# EAGLE design m101-psu-dcdc (EAGLE 7.6.0)
Assembly variants: 9V-36V Input (Pos ON), 9V-36V Input (Neg ON), +15V/0/-15V Input
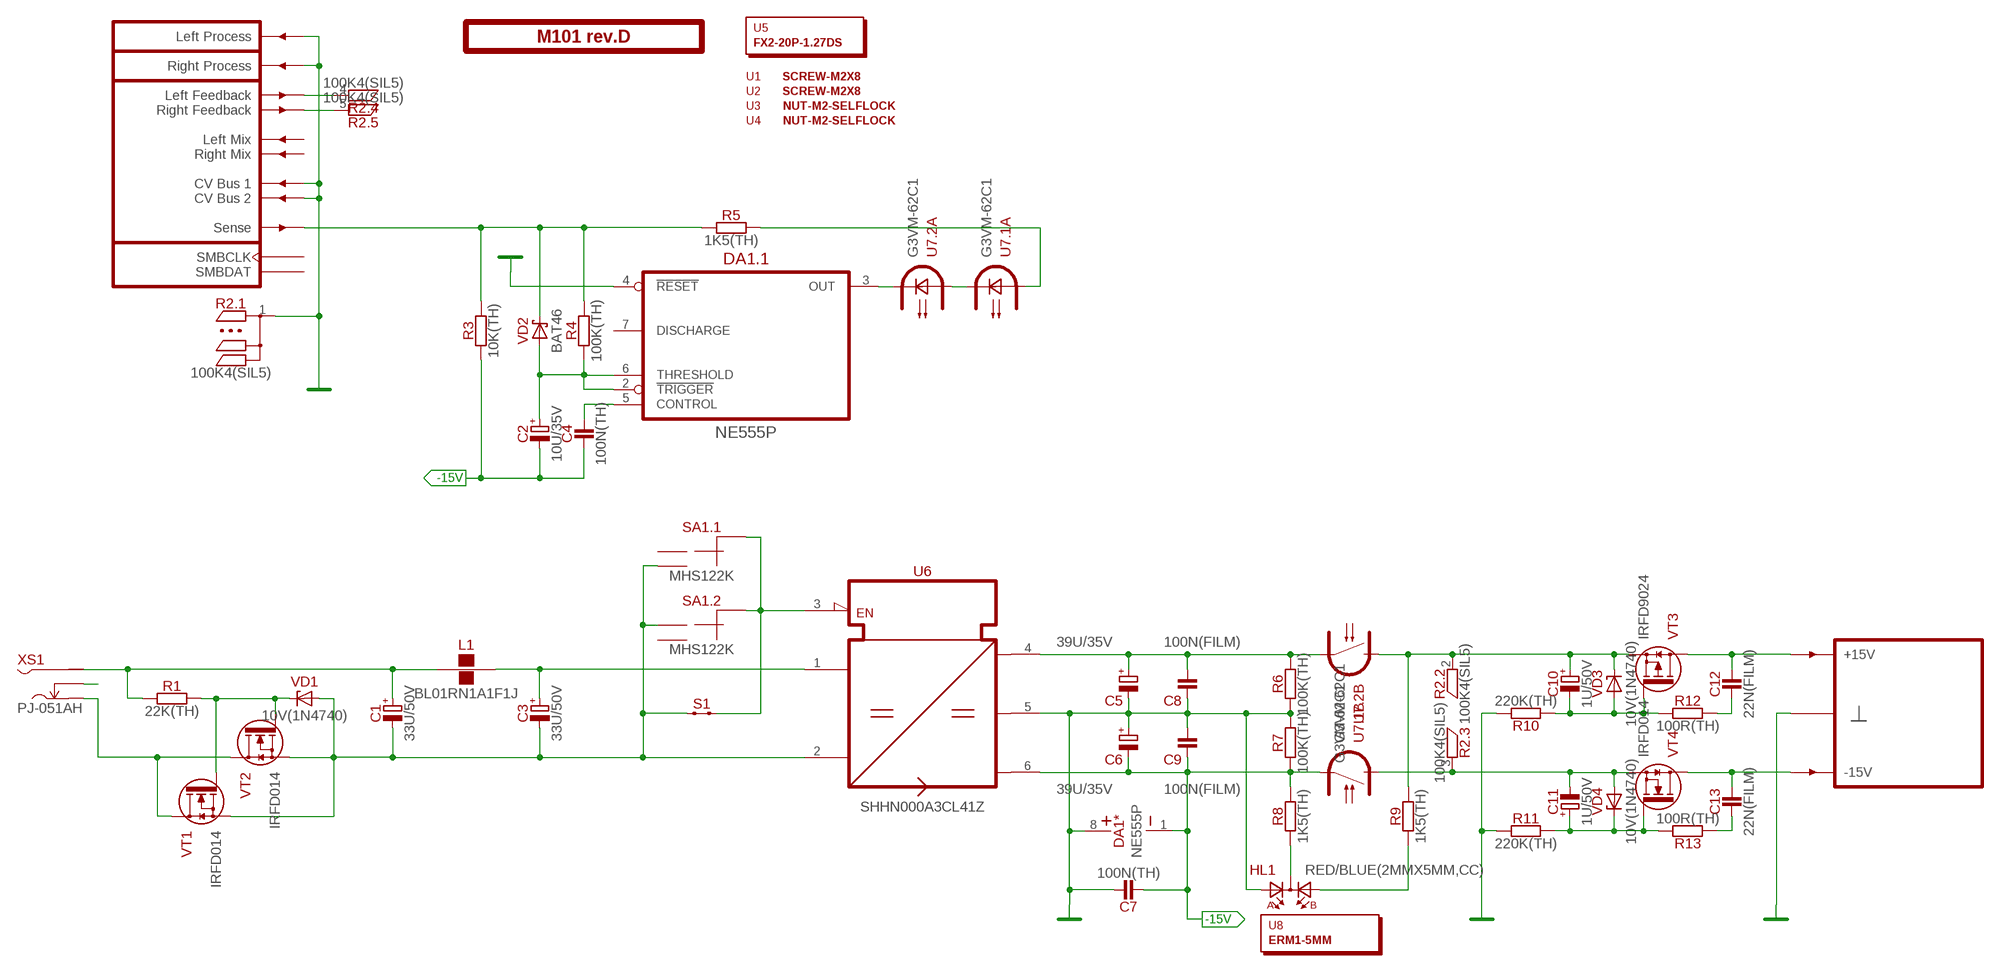
[diagram p0: schematic, sheet 1]

## Parts
C1  33U/50V  [E3,5-8]
C2  10U/35V  [E2-5]
C3  33U/50V  [E3,5-8]
C4  100N(TH)  [C050-024X044]
C5  39U/35V  [E3,5-8]
C6  39U/35V  [E3,5-8]
C7  100N(TH)  [C050-024X044]
C8  100N(FILM)  [C050-025X075]
C9  100N(FILM)  [C050-025X075]
C10  1U/50V  [E1,5-4]
C11  1U/50V  [E1,5-4]
C12  22N(FILM)  [C050-025X075]
C13  22N(FILM)  [C050-025X075]
DA1  NE555P  [DIP-8]
HL1  RED/BLUE(2MMX5MM,CC)  [LED2X5-3PIN]
L1  BL01RN1A1F1J  [BL01RN1A]  (not fitted in variant +15V/0/-15V Input)
PCB1  M101 rev.D  ST2-BOARD-50-PSU  [ST2-BOARD-50-PSU]
R1  22K(TH)  [R-0207/10]
R2  100K4(SIL5)  [R-SIL5]
R3  10K(TH)  [R-0207/10]
R4  100K(TH)  [R-0207/10]
R5  1K5(TH)  [R-0207/10]
R6  100K(TH)  [R-0207/10]
R7  100K(TH)  [R-0207/10]
R8  1K5(TH)  [R-0207/10]
R9  1K5(TH)  [R-0207/10]
R10  220K(TH)  [R-0207/10]
R11  220K(TH)  [R-0207/10]
R12  100R(TH)  [R-0207/10]
R13  100R(TH)  [R-0207/10]
S1  JUMPER-1POS-SOLDER  [JP1-SOLDER]
SA1  MHS122K  [APEM-MHS122K]
U1  SCREW-M2X8  [EMPTY]
U2  SCREW-M2X8  [EMPTY]
U3  NUT-M2-SELFLOCK  [EMPTY]
U4  NUT-M2-SELFLOCK  [EMPTY]
U5  FX2-20P-1.27DS  [EMPTY]
U6  SHHN000A3CL41Z  [DC/DC-C1]  (not fitted in variant +15V/0/-15V Input)
U7  G3VM-62C1  [DIL08]
U8  ERM1-5MM  [EMPTY]
VD1  10V(1N4740)  [DO41-10]
VD2  BAT46  [DO35-7]
VD3  10V(1N4740)  [DO41-10]
VD4  10V(1N4740)  [DO41-10]
VT1  IRFD014  [HVMDIP-4]
VT2  IRFD014  [HVMDIP-4]
VT3  IRFD9024  [HVMDIP-4]
VT4  IRFD014  [HVMDIP-4]
XS1  PJ-051AH  [PJ-051AH]

## Nets
-15V: C2.- C4.1 C6.- C7.1 C9.1 DA1.1(*:V-) R3.1 R7.1 R8.2 U6.6(V-) U7.7(.1B:S2)
GND: C5.- C6.+ C7.2 C8.1 C9.2 DA1.4(.1:!RESET) DA1.8(*:V+) HL1.A1 PCB1.ACV1'(CV1') PCB1.ACV2'(CV2') PCB1.B4'(GND) PCB1.B5'(GND) PCB1.B6'(GND) PCB1.B7'(GND) PCB1.B8'(GND) PCB1.BOUTL'(OUTL) PCB1.BOUTR'(OUTR) R2.1 R6.1 R7.2 R10.2 R11.2 U6.5(GND)
N$1: R5.2 U7.1(.1A:A)
N$2 [power]: XS1.2(SS)
N$3 [power]: C1.- C3.- S1.1 SA1.1' SA1.2 U6.2(IN-) VD1.A VT1.4(S) VT2.4(S)
N$4: PCB1.ALFBK'(LFBK') R2.4
N$5: PCB1.ARFBK'(RFBK') R2.5
N$6: C4.2 DA1.5(.1:CONTROL)
N$7: DA1.3(.1:OUT) U7.4(.2A:C)
N$8 [power]: VT1.1(D) VT1.2(D) VT2.1(D) VT2.2(D) XS1.3(S)
N$9: U7.2(.1A:C) U7.3(.2A:A)
N$10: C2.+ DA1.2(.1:!TRIGGER) DA1.6(.1:THRESHOLD) R4.1 VD2.A
N$11: C10.+ R2.2 R9.2 U7.6(.2B:S1) VD3.C VT3.4(S)
N$12 [power]: R1.2 VD1.C VT1.3(G) VT2.3(G)
N$13: HL1.K R8.1
N$14: HL1.A2 R9.1
N$15: C5.+ C8.2 R6.2 U6.4(V+) U7.5(.2B:S2)
N$16 [power]: S1.2 SA1.CMN'(.2:CM) SA1.CMN(.1:CM) U6.3(EN)
N$17: C10.- R10.1 R12.1 VD3.A VT3.3(G)
N$18: C12.2 PCB1.A+15'(P+15V) PCB1.B+15'(P+15V) VT3.1(D) VT3.2(D)
N$19: C12.1 R12.2
N$20 [power]: C1.+ L1.1 R1.1 XS1.1(P)
N$21: C13.1 PCB1.A-15'(P-15V) PCB1.B-15'(P-15V) VT4.1(D) VT4.2(D)
N$22 [power]: C3.+ L1.2 U6.1(IN+)
N$23: C13.2 R13.2
N$24: C11.+ R11.1 R13.1 VD4.C VT4.3(G)
N$25: C11.- R2.3 U7.8(.1B:S1) VD4.A VT4.4(S)
SENSE: PCB1.BSENSE'(SENSE') R3.2 R4.2 R5.1 VD2.C
Unconnected: DA1.7(.1:DISCHARGE) PCB1.ALMIX'(LMIX') PCB1.ARMIX'(RMIX') PCB1.ASMBCLK'(SMBCLK) PCB1.ASMBDAT'(SMBDAT) SA1.1 SA1.2'

## Library data of the parts
C1 C3 = capacitors-electrolytic:?; MOUSER: 661-EKZE500ELL330MH0
C2 = capacitors-electrolytic:?; MOUSER: 647-USW1V100MDD
C4 C7 = capacitors:?; MOUSER: 81-RCER71H104K0A2H3B
C5 C6 = capacitors-electrolytic:?; MOUSER: 667-35SEPF39M
C8 C9 = capacitors:?; MOUSER: 505-MKS2.1/63/5
C10 C11 = capacitors-electrolytic:?; MOUSER: 647-USW1H010MDD
C12 C13 = capacitors:?; MOUSER: 80-R82EC2220DQ50J
DA1 = ic-logic:NE555?; MOUSER: 595-NE555P
HL1 = optoelectronics:?(2MMX5MM,CC)
L1 = inductors:BL01RN1A?; MOUSER: 81-BL01RN1A1F1J
PCB1 = module-footprints:ST2-BOARD-50-PSU
R1 = resistors:?; MOUSER: 71-CCF0722K0GKE36
R2 = resistors:?**4(SIL5); MOUSER: 652-4605X-1LF-100K
R3 = resistors:?; MOUSER: 71-RN55D-F-10K
R4 R6 R7 = resistors:?; MOUSER: 71-RN55D-F-100K
R5 R8 R9 = resistors:?; MOUSER: 71-CCF071K50GKE36
R10 R11 = resistors:?
R12 R13 = resistors:?; MOUSER: 71-RN55D-F-100/R
S1 = switches:JUMPER-1POS-SOLDER
SA1 = switches:MHS122K; MOUSER: 642-MHS122K
U1-U4 = hardware:*?
U5 = hardware:?; MOUSER: 798-FX2-20P-1.27DS71
U6 = regulators-switch-mode:SHHN000A3CL41Z; MOUSER: 894-SHHN000A3CL41Z
U7 = optoelectronics:G3VM-?2C; MOUSER: 653-G3VM-62C1
U8 = hardware:?
VD1 VD3 VD4 = diodes-zener:?
VD2 = diodes-schottky:?; MOUSER: 511-BAT46
VT1 VT2 VT4 = transistors-fet:IRFD014
VT3 = transistors-fet:IRFD9024
XS1 = connectors:PJ-051?; MOUSER: 490-PJ-051AH

## Net classes
1 power: clearance 0.508 mm

## Board
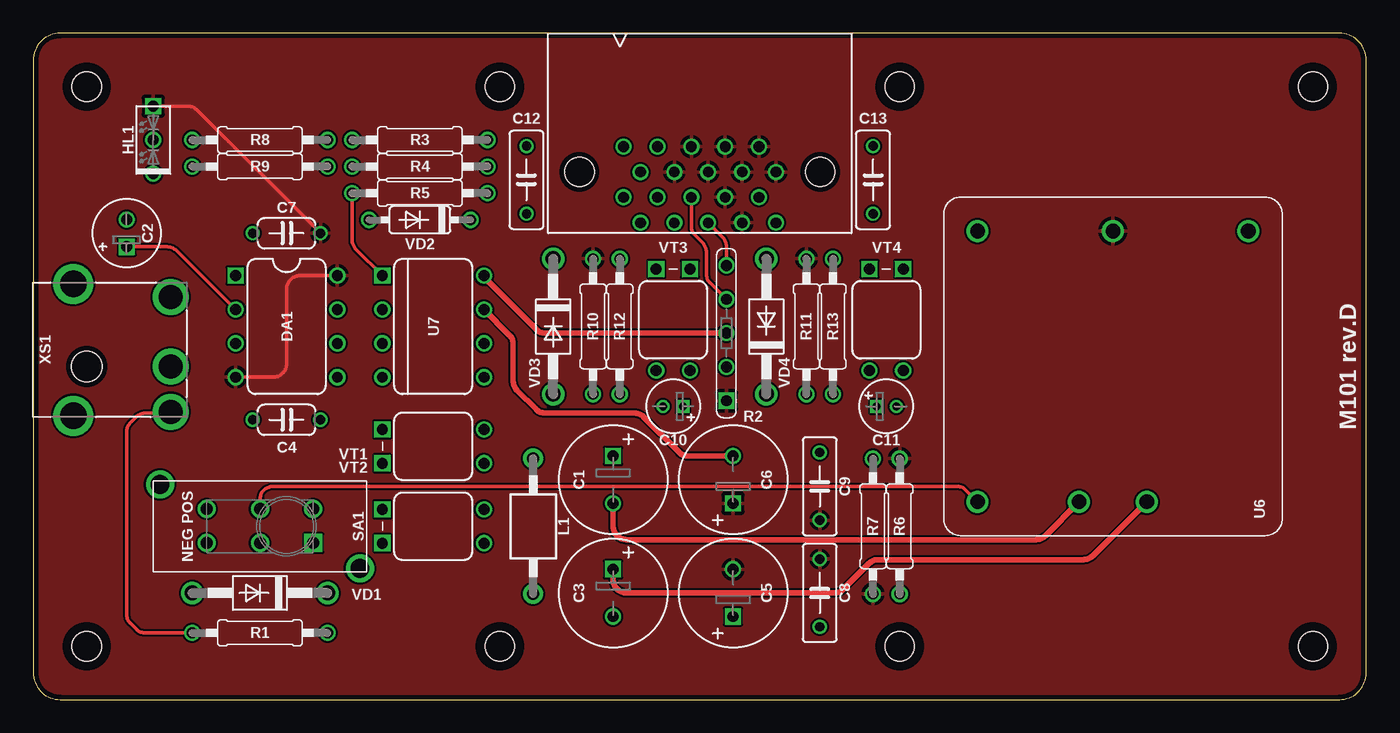
[diagram p1: board, top side]
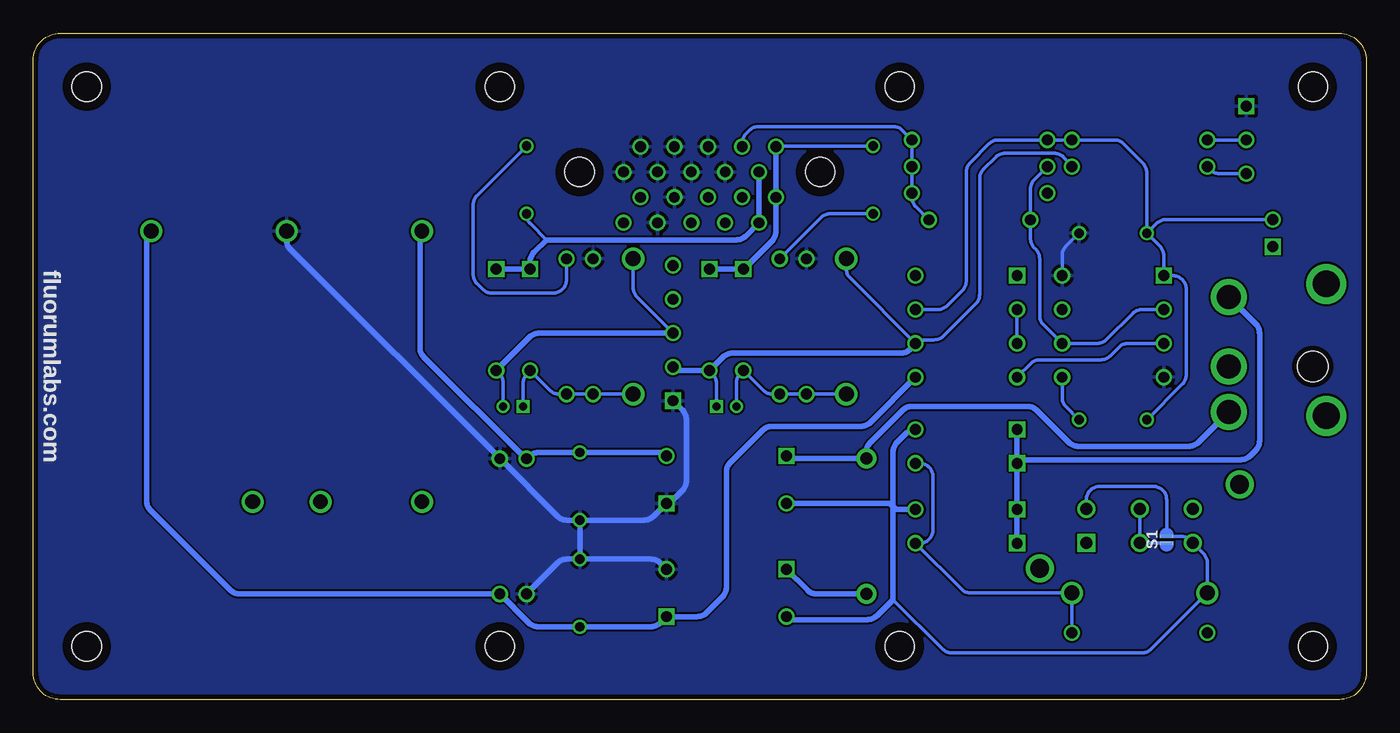
[diagram p2: board, bottom side, seen from below]

Size 100 x 50 mm. Coordinates in mm from the lower left corner, seen from the top.
Outline: 0,48 0,2 arc90 2,0 98,0 arc90 100,2 100,48 arc90 98,50 2,50 arc90 0,48
Copper layers (1*16): Top 0.0356mm / dielectric 1.5011mm / Bottom 0.0356mm
Design rules "LaenPCBOrder": minimum track width 6mil, minimum drill 13mil, track to track 6mil, track to pad 6mil, pad to pad 6mil, via to via 6mil, smd to smd 6mil, copper to edge 15mil, drill to drill 6mil, minimum pad ring 7mil, minimum via ring 7mil, stop-mask expansion 3mil, vias tented up to drill 0mil, thermal gap 10mil

### Footprints (pad centres in the part's own frame; a part is rotated, then mirrored left to right if it is on the bottom)
E3,5-8 = drill 0.813 square: + -1.778,0 | drill 0.813: - 1.778,0
E2-5 = drill 0.813 square: + -1.016,0 | drill 0.813: - 1.016,0
C050-024X044 = drill 0.7: 1 -2.54,0; 2 2.54,0
C050-025X075 = drill 0.7: 1 -2.54,0; 2 2.54,0
E1,5-4 = drill 0.6 square: + -0.75,0 | drill 0.6: - 0.75,0
DIP-8 = drill 0.813 square: 1 -3.81,-3.81 | drill 0.813: 2 -1.27,-3.81; 3 1.27,-3.81; 4 3.81,-3.81; 5 3.81,3.81; 6 1.27,3.81; 7 -1.27,3.81; 8 -3.81,3.81
LED2X5-3PIN = drill 0.813 square: A1 -2.54,0 | drill 0.813: A2 2.54,0; K 0,0
BL01RN1A = drill 0.9 pad 1.5: 1 -5.08,0; 2 5.08,0
ST2-BOARD-50-PSU = drill 0.8: A+15' 44.285,37.69; A-15' 45.555,35.785; ACV1' 51.905,37.69; ACV2' 53.175,35.785; ALFBK' 49.365,37.69; ALMIX' 46.825,37.69; ARFBK' 50.635,35.785; ARMIX' 48.095,35.785; ASMBCLK' 55.715,35.785; ASMBDAT' 54.445,37.69; B4' 48.095,39.595; B5' 49.365,41.5; B6' 50.635,39.595; B7' 51.905,41.5; B8' 53.175,39.595; B+15' 44.285,41.5; B-15' 45.555,39.595; BOUTL' 54.445,41.5; BOUTR' 55.715,39.595; BSENSE' 46.825,41.5 | hole 2.2: 4,4; 4,46; 96,4; 96,46; 35,46; 65,46; 65,4; 35,4; 40.975,39.595; 59.025,39.595
R-0207/10 = drill 0.813: 1 -5.08,0; 2 5.08,0
R-SIL5 = drill 0.813 square: 1 -5.08,0 | drill 0.813: 2 -2.54,0; 3 0,0; 4 2.54,0; 5 5.08,0
JP1-SOLDER = smd 0.254 x 1.016: 1 -0.254,0.026; 2 0.254,0.026
APEM-MHS122K = drill 0.9 square: 1 -4,1.25 | drill 0.9: 1' -4,-1.29; 2 4,1.25; 2' 4,-1.29; CMN 0,1.25; CMN' 0,-1.29 | drill 1.4: S1 -7.5,3.15; S2 7.5,-3.15
DC/DC-C1 = drill 1.1: 1 -10.16,-2.54; 2 -10.16,2.54; 3 -10.16,10.16; 4 10.16,-10.16; 5 10.16,0; 6 10.16,10.16
DIL08 = drill 0.813 square: 1 -3.81,-3.81 | drill 0.813: 2 -1.27,-3.81; 3 1.27,-3.81; 4 3.81,-3.81; 5 3.81,3.81; 6 1.27,3.81; 7 -1.27,3.81; 8 -3.81,3.81
DO41-10 = drill 1.118: A 5.08,0; C -5.08,0
DO35-7 = drill 0.813: A 3.81,0; C -3.81,0
HVMDIP-4 = drill 0.813 square: 1 -1.27,-3.81; 2 1.27,-3.81 | drill 0.813: 3 1.27,3.81; 4 -1.27,3.81
PJ-051AH = drill 1.8: 1 10.3,-3.4; 2 10.3,0; 3 10.3,5.2 | drill 2: S1 3,6.2; S2 3,-3.7 | hole 2.3: 4,0

### Placement (x,y rotation side)
C1  43.5,16.5 270 top
C2  7,35 90 top
C3  43.5,8 270 top
C4  19,21 0 top
C5  52.5,8 90 top
C6  52.5,16.5 90 top
C7  19,35 0 top
C8  59,8 270 top
C9  59,16 270 top
C10  48,22 180 top
C11  64,22 0 top
C12  37,39 90 top
C13  63,39 90 top
DA1  19,28 270 top
HL1  9,42 270 top
L1  37.5,13 270 top
PCB1  0,0 0 top
R1  17,5 0 top
R2  100K*4(SIL5)  [R-SIL5]  52,27.5 90 top
R3  29,42 0 top
R4  29,40 0 top
R5  29,38 180 top
R6  65,13 270 top
R7  63,13 270 top
R8  17,42 0 top
R9  17,40 0 top
R10  42,28 90 top
R11  58,28 90 top
R12  44,28 90 top
R13  60,28 90 top
S1  15,12 270 bottom
SA1  17,13 180 top
U1  -83,-103 0 top  (outside the outline)
U2  -84,-105 0 top  (outside the outline)
U3  -85,-107 0 top  (outside the outline)
U4  -86,-109 0 top  (outside the outline)
U5  -81,-99 0 top  (outside the outline)
U6  81,25 90 top
U7  30,28 270 top
U8  -82,-101 0 top  (outside the outline)
VD1  17,8 180 top
VD2  29,36 180 top
VD3  39,28 270 top
VD4  55,28 90 top
VT1  30,19 270 top
VT2  30,13 270 top
VT3  48,28.5 180 top
VT4  64,28.5 180 top
XS1  0,25 0 top

### Tracks (layer width: path | path; a pad name or v marks a point on that pad's centre or on a via)
-15V
  Top 0.406: C6.- 49.14,18.28 arc-45 48.43,18.57 45.79,21.21 arc45 45.09,21.5 38.41,21.5 arc-45 37.71,21.79 36.29,23.21 arc-45 36,23.91 36,26.67 arc45 35.71,27.37 U7.7
  Bottom 0.254: C7.1 15.48,34.02 arc45 15.19,33.32 DA1.1 14.5,31.81 arc90 13.5,30.81 13.5,24.37 arc45 13.79,23.67 C4.1 | C7.1 16.46,39.55 arc-45 16.75,40.25 18.21,41.71 arc-45 18.91,42 R8.2 R3.1 27.59,42 arc-45 28.29,41.71 29.71,40.29 arc-45 30,39.59 30,31.41 arc45 30.29,30.71 31.44,29.56 arc45 32.14,29.27 U7.7 | C2.- 15.03,36.02 arc-45 15.74,35.72 C7.1
  Bottom 0.406: C6.- arc-45 53.13,18.54 C9.1 62.13,18.54 arc-45 62.83,18.25 R7.1 63.08,18.08 70.71,25.71 arc45 71,26.41 71,35 U6.6
GND
  Top 0.254: DA1.4 18,24.19 arc90 19,25.19 19,30.81 arc-90 20,31.81 DA1.8 | HL1.A1 11.59,44.54 arc-45 12.29,44.25 C7.2
  Bottom 0.254: DA1.8 22.81,33.32 arc45 22.52,34.02 C7.2
  Bottom 0.406: C8.1 53.68,10.54 arc45 52.97,10.25 C5.- | C9.2 54.18,13.46 arc-45 53.47,13.75 C6.+ 52.28,14.72 51.29,15.71 arc-45 51,16.41 51,21.01 arc-45 51.29,21.71 R2.1 | C8.1 C9.2 | C8.1 59.97,10.54 arc-45 60.67,10.25 R7.2 | C9.2 59.97,13.46 arc45 60.67,13.75 R6.1 80.71,33.79 arc45 81,34.49 U6.5
  pour Bottom: 0,50 100,50 100,0 0,0
  pour Top: 0,50 100,50 100,0 0,0
N$1
  Top 0.254: R5.2 23.92,34.49 arc45 24.21,33.79 U7.1
N$3
  Top 0.406: C1.- 43.5,13 arc90 44.5,12 75.21,12 arc45 75.91,12.29 U6.2
  Bottom 0.254: SA1.1' 21,15 arc90 20,16 15.97,16 arc90 14.97,15 S1.1 13.92,12.25 arc45 13.21,11.96 SA1.2 12.21,10.96 arc45 11.92,10.26 VD1.A 16.13,3.79 arc45 16.83,3.5 31.09,3.5 arc45 31.79,3.79 35.5,7.5
  Bottom 0.406: VT1.4 VT1.4 arc-45 34.52,19.98 35.21,19.29 arc-45 35.5,18.59 35.5,14.5 | 35.5,14.5 35.5,7.5 36.71,6.29 arc45 37.41,6 43.28,6 C3.- | VT2.4 35.27,14.27 35.5,14.5 | C1.- 35.72,14.72 35.5,14.5
N$4
  Top 0.254: PCB1.ALFBK' 49.37,35.55 arc45 49.66,34.84 50.21,34.29 arc-45 50.5,33.59 50.5,31.95 arc45 50.79,31.25 R2.4
N$5
  Top 0.254: R2.5 52,34.01 arc45 51.71,34.71 PCB1.ARFBK'
N$6
  Bottom 0.254: DA1.5 22.81,22.68 arc-45 22.52,21.98 C4.2
N$7
  Bottom 0.254: DA1.3 17.86,26.73 arc-45 18.56,26.44 19.21,25.79 arc45 19.91,25.5 24.47,25.5 arc-45 25.17,25.21 U7.4
N$8
  Bottom 0.406: VT1.2 25.92,18 9.41,18 arc-45 8.71,18.29 8.29,18.71 arc-45 8,19.41 8,27.49 arc-45 8.29,28.19 XS1.3 | VT1.1 VT1.2 | VT1.2 VT2.1 VT2.2
N$9
  Bottom 0.254: U7.3 U7.2
N$10
  Top 0.254: C2.+ 9.95,33.98 arc-45 10.85,33.61 DA1.2
  Bottom 0.254: R4.1 24.9,39.02 arc-45 25.19,38.32 VD2.A 25.19,34.6 arc-45 24.9,33.9 24.79,33.79 arc45 24.5,33.09 24.5,28.83 arc-45 24.21,28.13 DA1.6 20.18,26.73 arc-45 19.48,27.02 17.52,28.98 arc45 16.82,29.27 DA1.2
N$11
  Bottom 0.254: C10.+ 48.75,23.76 arc-45 49.04,24.46 VT3.4 | R9.2 22.08,40.08 22.71,40.71 arc-45 23.41,41 27.09,41 arc-45 27.79,40.71 28.71,39.79 arc-45 29,39.09 29,30.41 arc45 29.29,29.71 31.71,27.29 arc45 32.41,27 33.54,27 U7.6 38.71,31.63 arc45 39,32.33 VD3.C
  Bottom 0.406: U7.6 33.81,26.69 34.21,26.29 arc45 34.91,26 47.55,26 arc-45 48.25,25.71 VT3.4 51.73,24.69 R2.2
N$12
  Bottom 0.254: R1.2 VD1.C 29.67,8 arc45 30.37,8.29 VT2.3 33.5,11.73 arc-90 32.5,12.73 32.5,16.73 arc-90 33.5,17.73 VT1.3
N$13
  Bottom 0.254: HL1.K R8.1
N$14
  Bottom 0.254: HL1.A2 10.97,39.46 arc45 11.67,39.75 R9.1
N$15
  Bottom 0.406: U6.4 91.5,34.82 91.5,14.91 arc-45 91.21,14.21 85.21,8.21 arc-45 84.51,7.92 R6.2 62.83,5.75 arc-45 62.13,5.46 C8.2 53.68,5.46 arc-45 52.97,5.75 C5.+ 50.19,6.22 arc-45 49.48,6.51 48.29,7.71 arc-45 48,8.41 48,17.09 arc45 47.71,17.79 45.29,20.21 arc45 44.59,20.5 37.91,20.5 arc-45 37.21,20.79 U7.5
N$16
  Top 0.254: SA1.CMN' 17,15 arc-90 18,16 69.27,16 arc-45 69.97,15.71 U6.3
  Bottom 0.254: SA1.CMN' SA1.CMN S1.2
N$17
  Bottom 0.254: VD3.A R10.1 R12.1 44.55,22.92 arc45 45.25,23.21 VT3.3 46.96,24.46 arc-45 47.25,23.76 C10.-
N$18
  Bottom 0.254: C12.2 44.24,41.54 PCB1.B+15'
  Bottom 0.406: VT3.1 VT3.2 46.69,32.31 44.58,34.42 arc-45 44.28,35.13 PCB1.A+15' PCB1.B+15'
N$19
  Bottom 0.254: C12.1 40.21,36.46 arc-45 40.91,36.17 R12.2
N$20
  Top 0.254: R1.1 8.41,5 arc-45 7.71,5.29 7.29,5.71 arc-45 7,6.41 7,20.09 arc-45 7.29,20.79 7.71,21.21 arc-45 8.41,21.5 10.2,21.5 XS1.1
  Bottom 0.406: XS1.1 12.61,19.29 arc45 13.31,19 21.59,19 arc45 22.29,19.29 24.71,21.71 arc-45 25.41,22 34.09,22 arc-45 34.79,21.71 37.21,19.29 arc-45 37.5,18.59 L1.1 43.3,18.08 C1.+
N$21
  Bottom 0.254: C13.1 63,36.41 arc-45 62.71,35.71 61.5,34.5
  Bottom 0.406: VT4.1 VT4.2 62.73,32.86 arc45 62.44,33.56 61.5,34.5 47.25,34.5 arc-45 46.55,34.79 PCB1.A-15' PCB1.B-15'
N$22
  Top 0.406: C3.+ 43.5,9 arc90 44.5,8 60.09,8 arc45 60.79,8.29 62.71,10.21 arc-45 63.41,10.5 78.79,10.5 arc45 79.49,10.79 U6.1
  Bottom 0.406: L1.2 41.23,7.92 arc45 41.94,8.21 C3.+
N$23
  Bottom 0.254: R13.2 60,31.5 arc90 61,30.5 65.59,30.5 arc45 66.29,30.79 66.71,31.21 arc45 67,31.91 67,37.13 arc45 66.71,37.83 C13.2
N$24
  Bottom 0.254: VD4.C R11.1 R13.1 60.55,22.92 arc45 61.25,23.21 VT4.3 62.96,24.46 arc-45 63.25,23.76 C11.+
N$25
  Top 0.406: U7.8 33.81,31.69 37.71,27.79 arc45 38.41,27.5 R2.3
  Bottom 0.254: C11.- 64.75,23.76 arc-45 65.04,24.46 VT4.4 | VD4.A 55,30.91 arc-45 54.71,30.21 R2.3
  Bottom 0.406: R2.3 62.05,27.5 arc-45 62.75,27.21 VT4.4
SENSE
  Bottom 0.254: PCB1.BSENSE' 46.83,41.76 arc45 46.53,42.47 46.29,42.71 arc45 45.59,43 35.49,43 arc45 34.79,42.71 R3.2 R4.2 R5.1 34.08,37.68 arc-45 33.79,36.98 VD2.C

### Text on the board
tPlace: NEG POS